# EAGLE design Discharge Board rev2 (EAGLE 9.6.2)
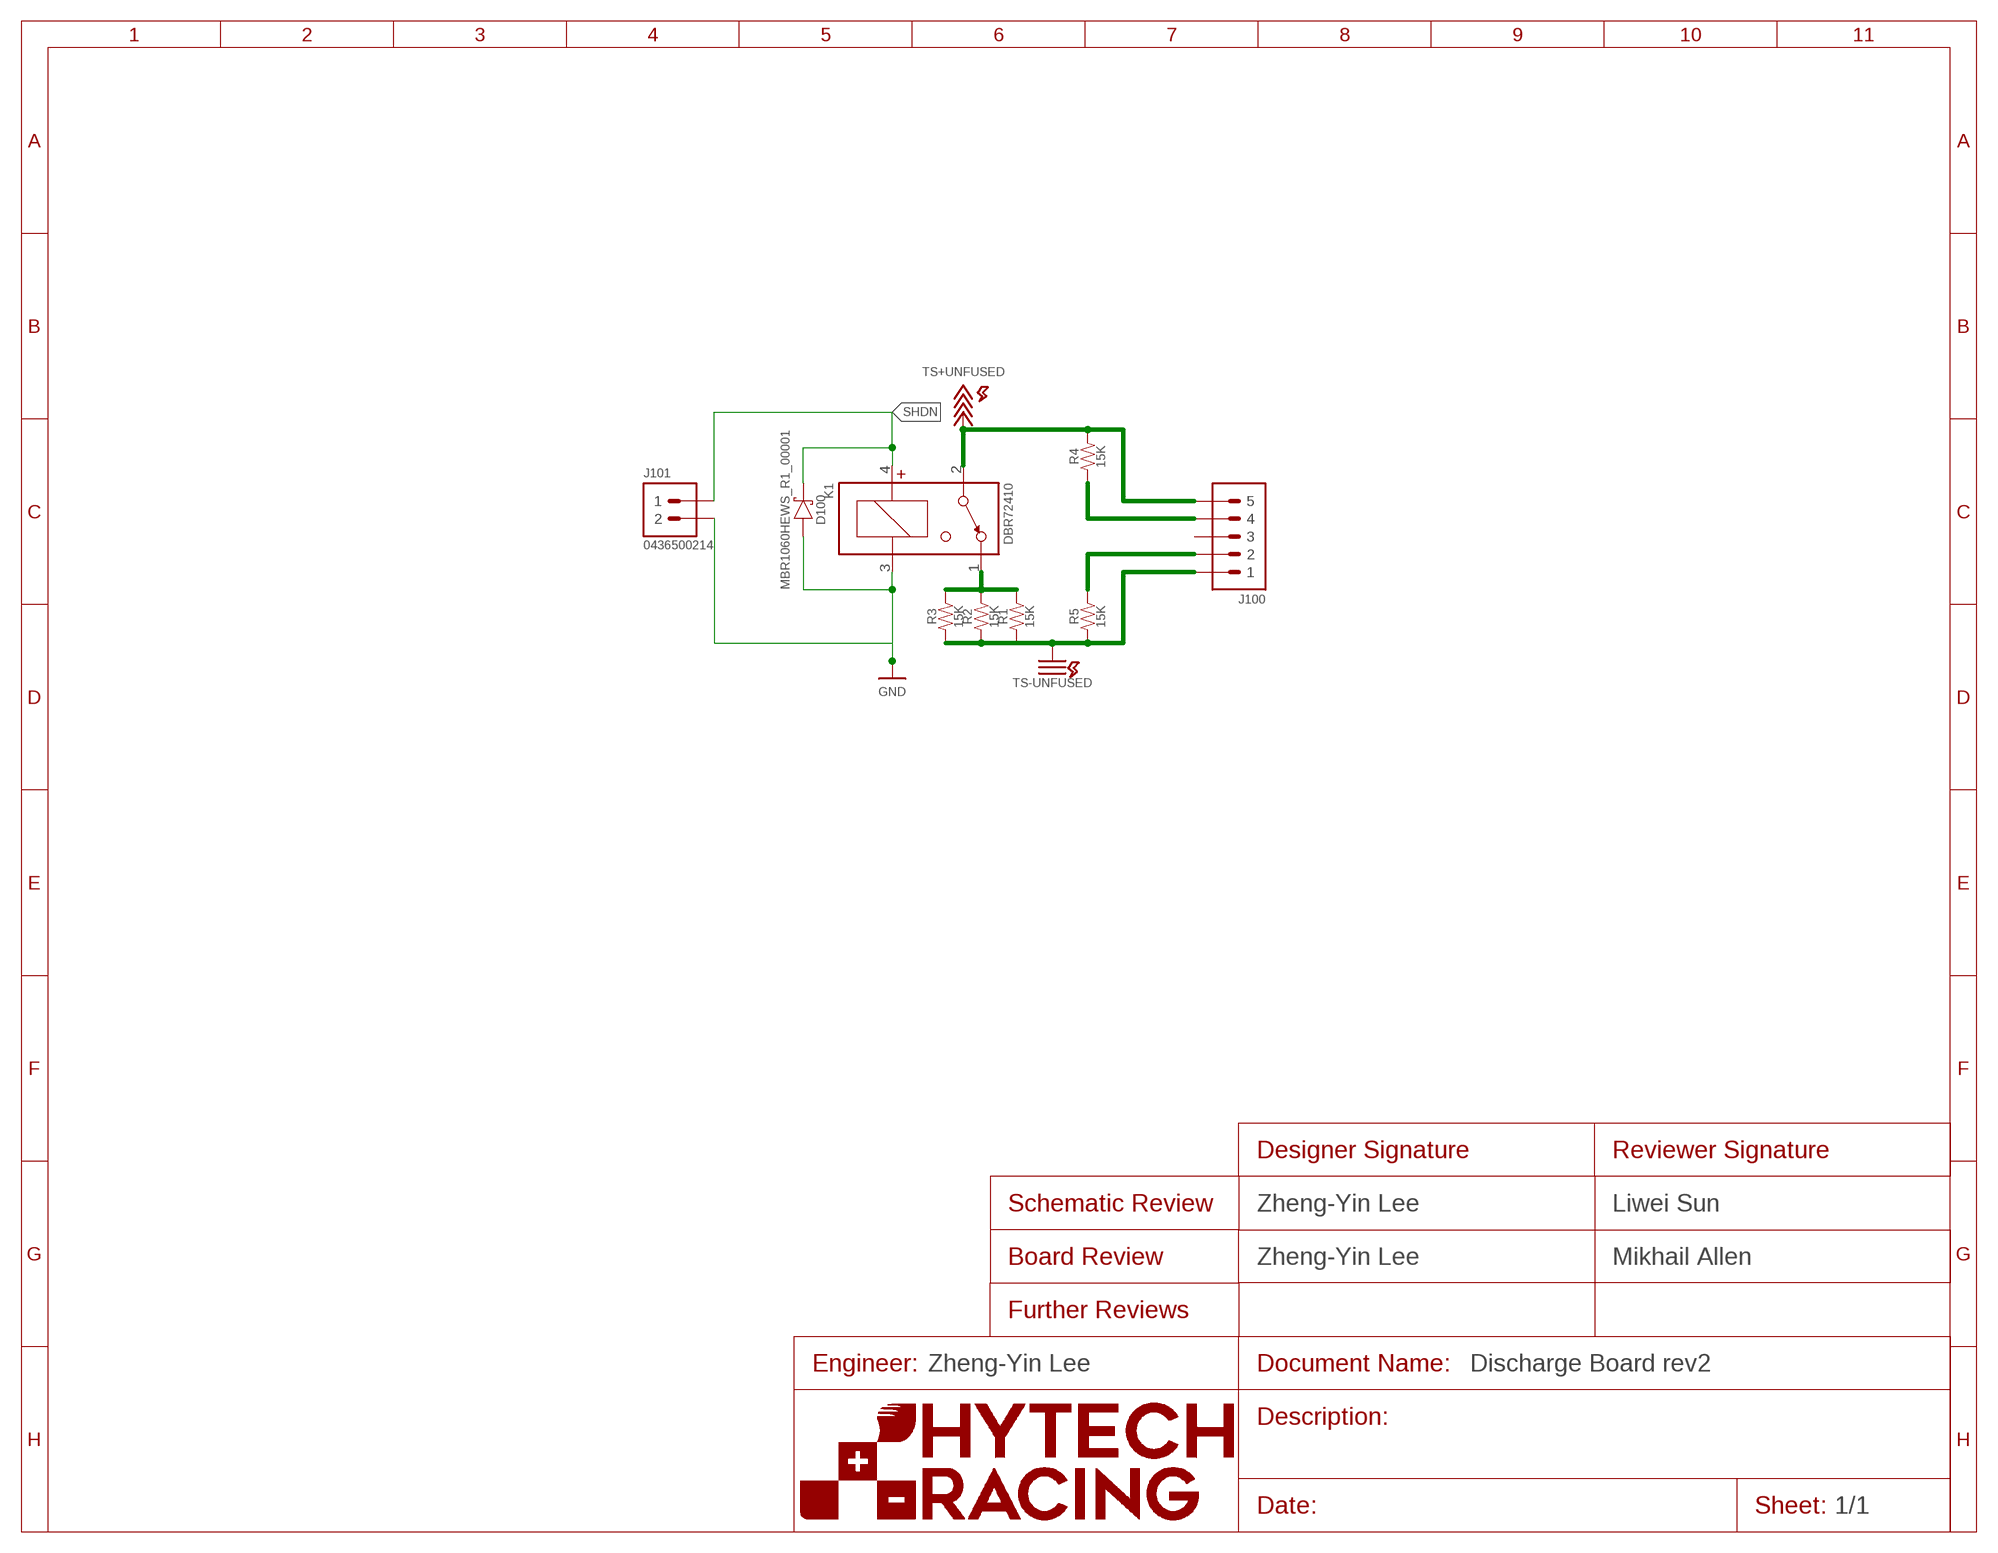
[diagram p0: schematic, sheet 1]
FRAME1 (FRAME): DESIGNER_BOARD: Zheng-Yin Lee; DESIGNER_SCHEMATIC: Zheng-Yin Lee; ENGINEER: Zheng-Yin Lee; REVIEWER_BOARD: Mikhail Allen; REVIEWER_SCHEMATIC: Liwei Sun

## Parts
D100  SCHOTTKY_SOD323_60V  [SOD-323]
J100  CONNECTOR-5_MICRO_R5S_  [MOLEX_MICROFIT_SMD_RIGHTANGLE_05_SINGLE]
J101  CONNECTOR-2_MICROFIT_SMD_RIGHTANGLE_02_SINGLE_BLACK  [MOLEX_MICROFIT_SMD_RIGHTANGLE_02_SINGLE]
K1  RELAY_SPST_NC_POLARIZED_D_24  [D]
R1  RESISTOR_B20-SHORTENED_15K  [B20-SHORTENED]
R2  RESISTOR_B20-SHORTENED_15K  [B20-SHORTENED]
R3  RESISTOR_B20-SHORTENED_15K  [B20-SHORTENED]
R4  RESISTOR_B20-SHORTENED_15K  [B20-SHORTENED]
R5  RESISTOR_B20-SHORTENED_15K  [B20-SHORTENED]

## Nets
GND: D100.A J101.2 K1.3(COIL-)
N$1: J100.2 R5.2
N$2: J100.4 R4.1
N$51: K1.1(CONTACT2) R1.2 R2.2 R3.2
SHDN: D100.C J101.1 K1.4(COIL+)
TS+UNFUSED: J100.5 K1.2(CONTACT1) R4.2
TS-UNFUSED: J100.1 R1.1 R2.1 R3.1 R5.1
Unconnected: J100.3

## Library data of the parts
D100 = HyTechDevices:SCHOTTKY_?_*: CUS08F30 Shottky Diode Datasheet <https://www.mouser.com/datasheet/2/408/CUS08F30_datasheet_en_20140414-1916097.pdf>; CURRENT: 1A; DKPN: 3757-MBR1060HEWS_R1_00001TR-ND; MANUFACTURER: Panjit International Inc.; MOPN: 241-MBR1060HEWSR1000; MPN: MBR1060HEWS_R1_00001; VOLTAGE: 60V
J100 = HyTechDevices:CONNECTOR-5_?_*
J101 = HyTechDevices:CONNECTOR-2_?_*: 2 Pin Connector; DKPN: WM14310CT-ND; MANUFACTURER: Molex; MOPN: 538-43650-0214; MPN: 0436500214
K1 = HyTechDevices:RELAY_SPST_NC_POLARIZED_?*: Single Pole, Single Throw Normally Closed Polarized Relay 355x Series <https://www.comus-intl.com/wp-content/uploads/2017/01/High-Voltage-Reed-Relays.pdf> D Series <https://www.mouser.com/datasheet/2/657/cynergy3_d_pcb_v2-1892244.pdf>; DKPN: 725-1050-ND; MANUFACTURER: Sensata-Cynergy3; MOPN: 285-DBR72410; MPN: DBR72410
R1-R5 = HyTechDevices:RESISTOR_?_*: Resistor PWR163 Series <https://www.mouser.com/datasheet/2/54/pwr163-777985.pdf> AC Series <https://www.mouser.com/datasheet/2/447/Yageo_PYu_AC_51_RoHS_L_7_1714230-1874691.pdf> PU Series <https://www.mouser.com/datasheet/2/447/PYu-PU_51_RoHS_L_6-1504619.pdf> ERA Series <https://www.mouser.com/datasheet/2/315/AOA0000C307-1149632.pdf> PWR263 Series <https://www.mouser.com/datasheet/2/54/pwr263s_35-778069.pdf> KTR Series <https://www.mouser.com/datasheet/2/348/ROHM_S_A0011075115_1-2563276.pdf> RC Series <https://www.mouser.com/datasheet/2/447/Yageo_03_18_2021_PYu_RC_Group_51_RoHS_L_11-2199992.pdf> ERJ PB3, PB6 Series <https://www.mouser.com/datasheet/2/315/AOA0000C328-1530132.pdf> ERJ PA2, P03, PA3, P06, P08, P14 Series <https://www.mouser.com/datasheet/2/315/AOA0000C331-1141874.pdf> B20 Series <https://www.ohmite.com/assets/docs/res_200.pdf?r=false> TE Connectivity/Holsworthy RN73 Series <https://www.mouser.com/datasheet/2/418/4/NG_DS_1773270_M-604713.pdf> Vishay Dale D/CRCW e3 <https://www.mouser.com/datasheet/2/427/dcrcwe3-1762152.pdf> Ohmite B20 <https://www.ohmite.com/assets/docs/res_200.pdf?r=false>; DKPN: B20J15KE-ND; MANUFACTURER: Ohmite; MOPN: 588-B20J15KE; MPN: B20J15KE; POWER: 20W; RESISTANCE: 15K; TOLERANCE: 5%; VOLTAGE_CONTINUOUS: 548V; VOLTAGE_MAX: 750V

## Board
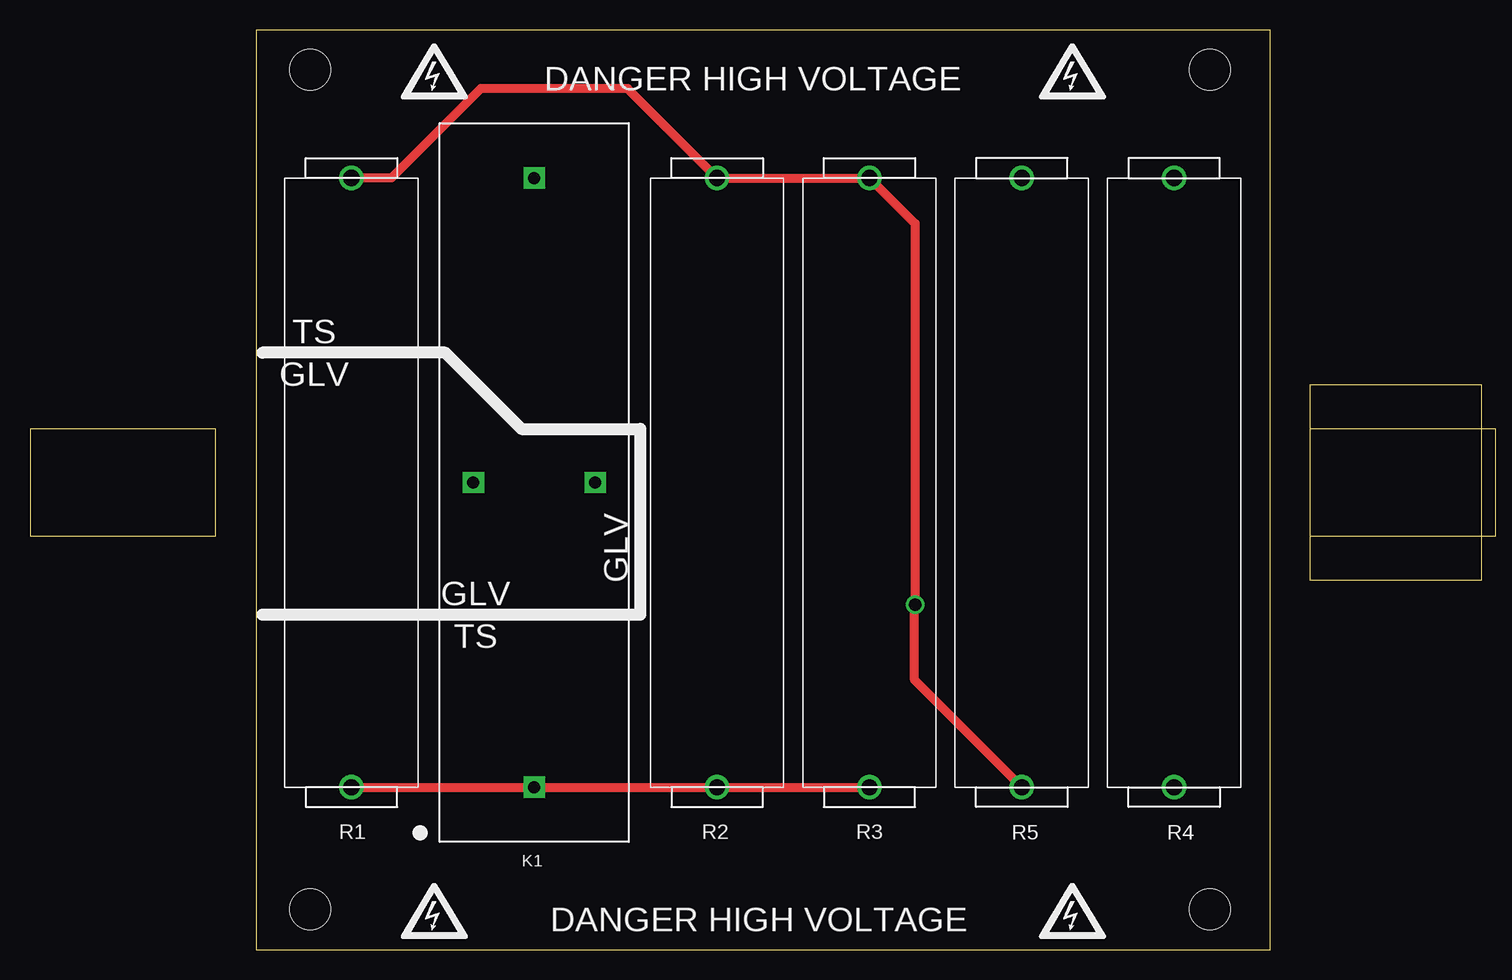
[diagram p1: board, top side]
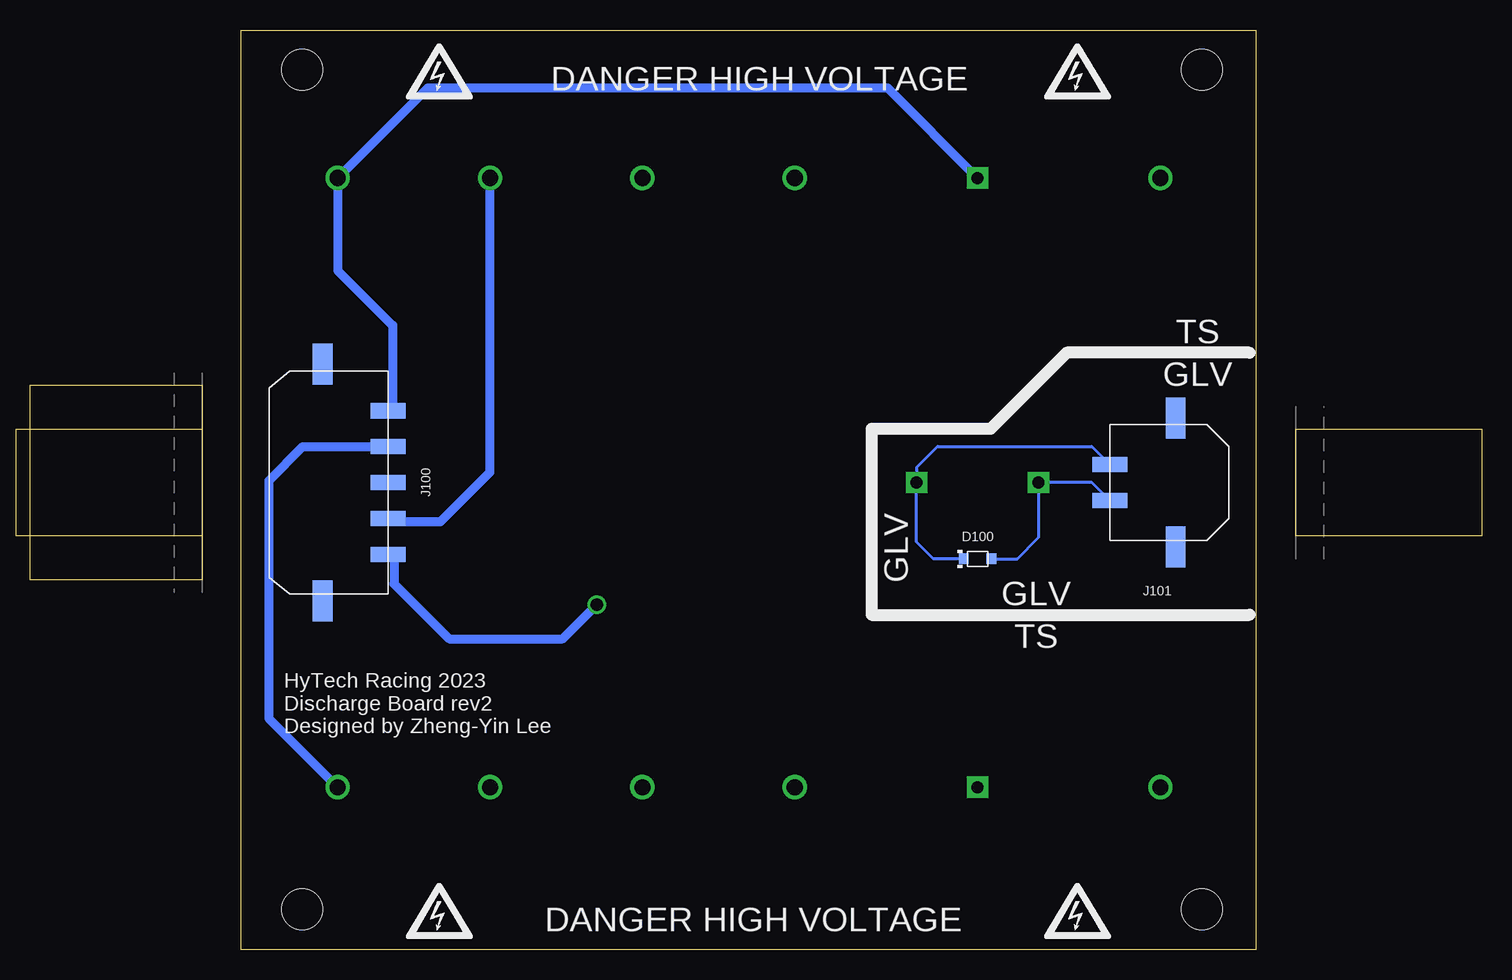
[diagram p2: board, bottom side, seen from below]

Size 84.58 x 76.7 mm. Coordinates in mm from the lower left corner, seen from the top.
Outline: 0,0 84.58,0 84.58,76.7 0,76.7 0,0
Copper layers (1*16): Top 0.035mm / dielectric 1.53mm / Bottom 0.035mm
Design rules "HyTech Default (2 Layer)": minimum track width 6mil, minimum drill 14mil, track to track 6mil, track to pad 6mil, pad to pad 6mil, via to via 20mil, smd to smd 6mil, copper to edge 20mil, drill to drill 21mil, minimum pad ring 7mil, minimum via ring 8mil, stop-mask expansion 6mil, vias tented up to drill 30mil, thermal gap 10mil

### Footprints (pad centres in the part's own frame; a part is rotated, then mirrored left to right if it is on the bottom)
SOD-323 = smd 0.8 x 0.9: A -1.15,0; C 1.15,0
MOLEX_MICROFIT_SMD_RIGHTANGLE_05_SINGLE = smd 1.27 x 2.921: 1 5.994,5.474; 2 2.997,5.474; 3 0,5.474; 4 -2.997,5.474; 5 -5.994,5.474 | smd 3.429 x 1.651: PAD1 9.879,0; PAD2 -9.879,0
MOLEX_MICROFIT_SMD_RIGHTANGLE_02_SINGLE = smd 1.27 x 2.921: 1 1.499,5.474; 2 -1.499,5.474 | smd 3.429 x 1.651: PAD1 5.372,0; PAD2 -5.372,0
D = drill 1 pad 1.778 square: 1 -25.4,0; 2 25.4,0; 3 0,5.08; 4 0,-5.08
B20-SHORTENED = drill 1.35: 1 25.4,0; 2 -25.4,0
MOUNTING_M3 = hole 3.4: 0,0

### Placement (x,y rotation side)
D100  23.2,32.61 180 bottom
J100  77.81,38.96 270 bottom
J101  6.69,38.96 90 bottom
K1  23.2,38.96 90 top
R1  7.96,38.96 90 top
R2  38.44,38.96 90 top
R3  51.14,38.96 90 top
R4  76.54,38.96 270 top
R5  63.84,38.96 270 top
U$1  [GLV]  4.86,48.01 0 top
U$2  [GLV]  18.32,29.72 180 top
U$3  [TS]  4.86,51.57 0 top
U$4  [TS]  18.32,26.17 0 top
U$5  [GLV]  30,33.53 90 top
U$6  [DANGER_HIGH_VOLTAGE]  41.91,2.54 0 top
U$7  [HV_MEDIUM]  14.87,3.25 0 top
U$8  [HV_MEDIUM]  14.87,73.25 0 top
U$9  [HV_MEDIUM]  68.07,3.25 0 top
U$10  [HV_MEDIUM]  68.07,73.25 0 top
U$11  [HV_MEDIUM]  68.07,73.25 0 bottom
U$12  [HV_MEDIUM]  14.87,73.25 0 bottom
U$13  [HV_MEDIUM]  68.07,3.25 0 bottom
U$14  [HV_MEDIUM]  14.87,3.25 0 bottom
U$15  [MOUNTING_M3]  4.5,3.4 0 top
U$16  [MOUNTING_M3]  79.5,3.4 0 top
U$17  [MOUNTING_M3]  4.5,73.4 0 top
U$18  [MOUNTING_M3]  79.5,73.4 0 top
U$19  [DANGER_HIGH_VOLTAGE]  41.4,72.64 0 top

### Tracks (layer width: path | path; a pad name or v marks a point on that pad's centre or on a via)
GND
  Bottom 0.254: J101.2 13.66,38.96 K1.3 18.12,34.39 19.9,32.61 D100.A
N$1
  Bottom 0.762: J100.2 72.08,35.71 67.97,35.71 63.84,39.84 R5.2
N$2
  Bottom 0.762: R4.1 82.3,19.32 82.3,39.12 79.45,41.96 J100.4
N$51
  Top 0.762: R1.2 K1.1 R2.2 R3.2
SHDN
  Bottom 0.254: D100.C 26.89,32.61 28.28,34 K1.4 28.28,40.23 26.53,41.99 13.69,41.99 J101.1
TS+UNFUSED
  Bottom 0.762: K1.2 30.7,71.86 69.05,71.86 R4.2 76.54,56.66 71.96,52.07 71.96,45.34 J100.5
TS-UNFUSED  (via drill 1.02)
  Top 0.762: R1.1 11.29,64.36 18.74,71.82 30.99,71.82 R2.1 R3.1 54.95,60.55 v54.95,28.78 54.9,28.73 54.9,22.5 R5.1
  Bottom 0.762: v54.95,28.78 57.8,25.93 67.26,25.93 71.86,30.53 71.86,32.49 J100.1

### Text on the board
bPlace: HyTech Racing 2023 / Discharge Board rev2 / Designed by Zheng-Yin Lee